# EAGLE schematic motor_controller (EAGLE 9.1.3)

## Sheet 1 of 2
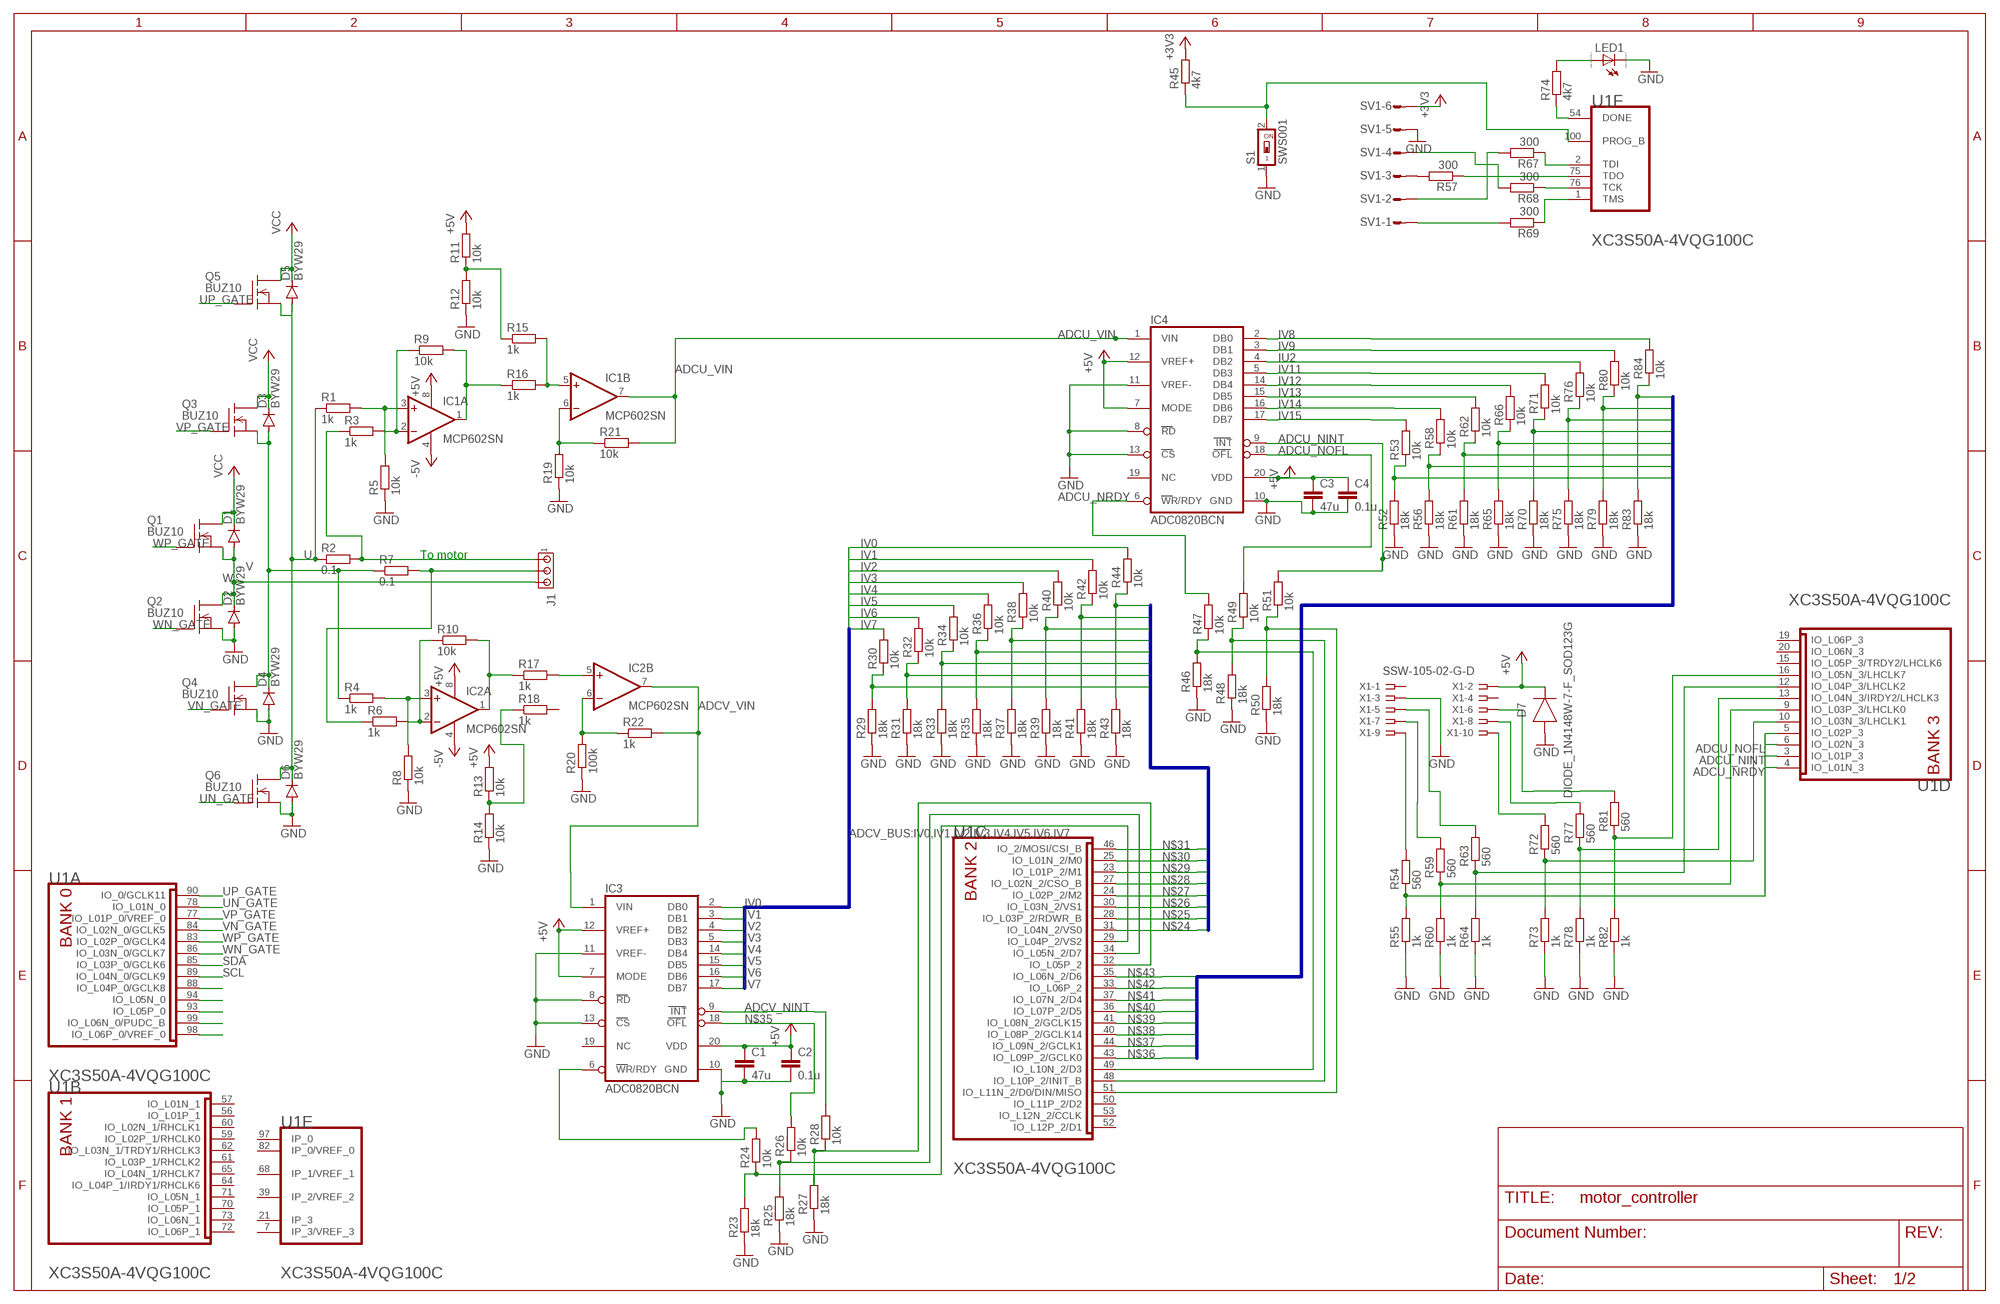
[diagram p0: schematic, sheet 1]

### Parts
C1  47u  C-EU025-040X050  [C025-040X050]
C2  0.1u  C-EUC1206  [C1206]
C3  47u  C-EU025-040X050  [C025-040X050]
C4  0.1u  C-EUC1206  [C1206]
D1  BYW29  [DO220S]
D2  BYW29  [DO220S]
D3  BYW29  [DO220S]
D4  BYW29  [DO220S]
D5  BYW29  [DO220S]
D6  BYW29  [DO220S]
D7  DIODE_1N4148W-7-F_SOD123G  [SOD3715X135]
IC1  MCP602SN  [SO08]
IC2  MCP602SN  [SO08]
IC3  ADC0820BCN  [DIL20]
IC4  ADC0820BCN  [DIL20]
J1  MTA03-156  [1X3MTA]
LED1  LED_E  [LED_1206]
Q1  BUZ10  [TO220]
Q2  BUZ10  [TO220]
Q3  BUZ10  [TO220]
Q4  BUZ10  [TO220]
Q5  BUZ10  [TO220]
Q6  BUZ10  [TO220]
R1  1k  R-EU_M1206  [M1206]
R2  0.1  R-EU_R2512  [R2512]
R3  1k  R-EU_M1206  [M1206]
R4  1k  R-EU_M1206  [M1206]
R5  10k  R-EU_M1206  [M1206]
R6  1k  R-EU_M1206  [M1206]
R7  0.1  R-EU_R2512  [R2512]
R8  10k  R-EU_M1206  [M1206]
R9  10k  R-EU_M1206  [M1206]
R10  10k  R-EU_M1206  [M1206]
R11  10k  R-EU_M1206  [M1206]
R12  10k  R-EU_M1206  [M1206]
R13  10k  R-EU_M1206  [M1206]
R14  10k  R-EU_M1206  [M1206]
R15  1k  R-EU_M1206  [M1206]
R16  1k  R-EU_M1206  [M1206]
R17  1k  R-EU_M1206  [M1206]
R18  1k  R-EU_M1206  [M1206]
R19  10k  R-EU_M1206  [M1206]
R20  100k  R-EU_M1206  [M1206]
R21  10k  R-EU_M1206  [M1206]
R22  1k  R-EU_M1206  [M1206]
R23  18k  R-EU_M1206  [M1206]
R24  10k  R-EU_M1206  [M1206]
R25  18k  R-EU_M1206  [M1206]
R26  10k  R-EU_M1206  [M1206]
R27  18k  R-EU_M1206  [M1206]
R28  10k  R-EU_M1206  [M1206]
R29  18k  R-EU_M1206  [M1206]
R30  10k  R-EU_M1206  [M1206]
R31  18k  R-EU_M1206  [M1206]
R32  10k  R-EU_M1206  [M1206]
R33  18k  R-EU_M1206  [M1206]
R34  10k  R-EU_M1206  [M1206]
R35  18k  R-EU_M1206  [M1206]
R36  10k  R-EU_M1206  [M1206]
R37  18k  R-EU_M1206  [M1206]
R38  10k  R-EU_M1206  [M1206]
R39  18k  R-EU_M1206  [M1206]
R40  10k  R-EU_M1206  [M1206]
R41  18k  R-EU_M1206  [M1206]
R42  10k  R-EU_M1206  [M1206]
R43  18k  R-EU_M1206  [M1206]
R44  10k  R-EU_M1206  [M1206]
R45  4k7  R-EU_M1206  [M1206]
R46  18k  R-EU_M1206  [M1206]
R47  10k  R-EU_M1206  [M1206]
R48  18k  R-EU_M1206  [M1206]
R49  10k  R-EU_M1206  [M1206]
R50  18k  R-EU_M1206  [M1206]
R51  10k  R-EU_M1206  [M1206]
R52  18k  R-EU_M1206  [M1206]
R53  10k  R-EU_M1206  [M1206]
R54  560  R-EU_M1206  [M1206]
R55  1k  R-EU_M1206  [M1206]
R56  18k  R-EU_M1206  [M1206]
R57  300  R-EU_M1206  [M1206]
R58  10k  R-EU_M1206  [M1206]
R59  560  R-EU_M1206  [M1206]
R60  1k  R-EU_M1206  [M1206]
R61  18k  R-EU_M1206  [M1206]
R62  10k  R-EU_M1206  [M1206]
R63  560  R-EU_M1206  [M1206]
R64  1k  R-EU_M1206  [M1206]
R65  18k  R-EU_M1206  [M1206]
R66  10k  R-EU_M1206  [M1206]
R67  300  R-EU_M1206  [M1206]
R68  300  R-EU_M1206  [M1206]
R69  300  R-EU_M1206  [M1206]
R70  18k  R-EU_M1206  [M1206]
R71  10k  R-EU_M1206  [M1206]
R72  560  R-EU_M1206  [M1206]
R73  1k  R-EU_M1206  [M1206]
R74  4k7  R-EU_M1206  [M1206]
R75  18k  R-EU_M1206  [M1206]
R76  10k  R-EU_M1206  [M1206]
R77  560  R-EU_M1206  [M1206]
R78  1k  R-EU_M1206  [M1206]
R79  18k  R-EU_M1206  [M1206]
R80  10k  R-EU_M1206  [M1206]
R81  560  R-EU_M1206  [M1206]
R82  1k  R-EU_M1206  [M1206]
R83  18k  R-EU_M1206  [M1206]
R84  10k  R-EU_M1206  [M1206]
S1  SWS001  [SMS-001]
SV1  MT6-6Y  [MT6-6Y]
U1  XILINX_XC3S50A-4VQG100CXILINX_XC3S50A-4VQG100C_0_0  [XILINX_XC3S50A-4VQG100C_0]
X1  SSW-105-02-G-D  [SSW-105-02-G-D]

### Nets
+3V3: R45.2 SV1.6 ; also sheet 2
+5V: C1.1 C2.1 C3.1 C4.1 D7.1(C) IC1.8(P:V+) IC2.8(P:V+) IC3.7(MODE) IC3.12(VREF+) IC3.20(VDD) IC4.7(MODE) IC4.12(VREF+) IC4.20(VDD) R11.2 R13.2 X1.2 ; also sheet 2
-5V: IC1.4(P:V-) IC2.4(P:V-) ; also sheet 2
ADCU_NINT: IC4.9(INT) R51.2 U1.3(D:IO_L01P_3)
ADCU_NOFL: IC4.18(OFL) R49.2 U1.6(D:IO_L02N_3)
ADCU_NRDY: IC4.6(WR/RDY) R47.2 U1.4(D:IO_L01N_3)
ADCU_VIN: IC1.7(B:OUT) IC4.1(VIN) R21.2
ADCV_NINT: IC3.9(INT) R28.2
ADCV_NRDY: IC3.6(WR/RDY) R24.2
ADCV_VIN: IC2.7(B:OUT) IC3.1(VIN) R22.2
GND: C1.2 C2.2 C3.2 C4.2 D2.A D4.A D6.A D7.2(A) IC3.8(RD) IC3.10(GND) IC3.11(VREF-) IC3.13(CS) IC4.8(RD) IC4.10(GND) IC4.11(VREF-) IC4.13(CS) LED1.C Q2.3(S) Q4.3(S) Q6.3(S) R5.1 R8.1 R12.1 R14.1 R19.1 R20.1 R23.1 R25.1 R27.1 R29.1 R31.1 R33.1 R35.1 R37.1 R39.1 R41.1 R43.1 R46.1 R48.1 R50.1 R52.1 R55.1 R56.1 R60.1 R61.1 R64.1 R65.1 R70.1 R73.1 R75.1 R78.1 R79.1 R82.1 R83.1 S1.1 SV1.5 X1.3 ; also sheet 2
IU2: IC4.4(DB2) R76.2
IV0: IC3.2(DB0) R44.2
IV1: IC3.3(DB1) R42.2
IV2: IC3.4(DB2) R40.2
IV3: IC3.5(DB3) R38.2
IV4: IC3.14(DB4) R36.2
IV5: IC3.15(DB5) R34.2
IV6: IC3.16(DB6) R32.2
IV7: IC3.17(DB7) R30.2
IV8: IC4.2(DB0) R84.2
IV9: IC4.3(DB1) R80.2
IV11: IC4.5(DB3) R71.2
IV12: IC4.14(DB4) R66.2
IV13: IC4.15(DB5) R62.2
IV14: IC4.16(DB6) R58.2
IV15: IC4.17(DB7) R53.2
N$1: J1.2 R6.1 R7.2
N$2: J1.1 R2.2 R3.1
N$3: IC2.5(B:+IN) R17.2
N$4: IC1.3(A:+IN) R1.2 R5.2
N$5: IC1.1(A:OUT) R9.2 R16.1
N$7: R67.1 U1.2(F:TDI)
N$8: R68.1 U1.76(F:TCK)
N$9: D5.A Q5.3(S)
N$10: U1.88(A:IO_L04P_0/GCLK8)
N$11: U1.94(A:IO_L05N_0)
N$12: U1.93(A:IO_L05P_0)
N$13: U1.99(A:IO_L06N_0/PUDC_B)
N$14: U1.98(A:IO_L06P_0/VREF_0)
N$15: IC2.1(A:OUT) R10.2 R17.1
N$16: IC2.2(A:-IN) R6.2 R10.1
N$20: IC1.2(A:-IN) R3.2 R9.1
N$21: IC1.6(B:-IN) R19.2 R21.1
N$22: IC2.3(A:+IN) R4.2 R8.2
N$23: IC2.6(B:-IN) R20.2 R22.1
N$24: R29.2 R30.1 U1.31(C:IO_L04N_2/VS0)
N$25: R31.2 R32.1 U1.28(C:IO_L03P_2/RDWR_B)
N$26: R33.2 R34.1 U1.30(C:IO_L03N_2/VS1)
N$27: R35.2 R36.1 U1.24(C:IO_L02P_2/M2)
N$28: R37.2 R38.1 U1.27(C:IO_L02N_2/CSO_B)
N$29: R39.2 R40.1 U1.23(C:IO_L01P_2/M1)
N$30: R41.2 R42.1 U1.25(C:IO_L01N_2/M0)
N$31: R43.2 R44.1 U1.46(C:IO_2/MOSI/CSI_B)
N$32: R23.2 R24.1 U1.29(C:IO_L04P_2/VS2)
N$33: R25.2 R26.1 U1.34(C:IO_L05N_2/D7)
N$34: R27.2 R28.1 U1.32(C:IO_L05P_2)
N$35: IC3.18(OFL) R26.2
N$36: R52.2 R53.1 U1.43(C:IO_L09P_2/GCLK0)
N$37: R56.2 R58.1 U1.44(C:IO_L09N_2/GCLK1)
N$38: R61.2 R62.1 U1.40(C:IO_L08P_2/GCLK14)
N$39: R65.2 R66.1 U1.41(C:IO_L08N_2/GCLK15)
N$40: R70.2 R71.1 U1.36(C:IO_L07P_2/D5)
N$41: R75.2 R76.1 U1.37(C:IO_L07N_2/D4)
N$42: R79.2 R80.1 U1.33(C:IO_L06P_2)
N$43: R83.2 R84.1 U1.35(C:IO_L06N_2/D6)
N$44: R50.2 R51.1 U1.51(C:IO_L11N_2/D0/DIN/MISO)
N$45: R48.2 R49.1 U1.48(C:IO_L10P_2/INIT_B)
N$46: R46.2 R47.1 U1.49(C:IO_L10N_2/D3)
N$47: R69.1 U1.1(F:TMS)
N$48: R69.2 SV1.1
N$49: R67.2 SV1.2
N$50: R68.2 SV1.4
N$51: R57.2 SV1.3
N$52: R57.1 U1.75(F:TDO)
N$53: LED1.A R74.2
N$54: R45.1 S1.2 U1.100(F:PROG_B)
N$55: R74.1 U1.54(F:DONE)
N$56: R63.2 X1.5
N$57: R59.2 X1.7
N$58: R54.2 X1.9
N$59: IC1.5(B:+IN) R15.2 R16.2
N$60: R77.2 X1.8
N$61: R72.2 X1.10
N$62: R54.1 R55.2 U1.5(D:IO_L02P_3)
N$63: R59.1 R60.2 U1.9(D:IO_L03P_3/LHCLK0)
N$64: R63.1 R64.2 U1.12(D:IO_L04P_3/LHCLK2)
N$65: R81.2 X1.6
N$66: R13.1 R14.2 R18.1
N$67: R11.1 R12.2 R15.1
N$68: R72.1 R73.2 U1.10(D:IO_L03N_3/LHCLK1)
N$69: R77.1 R78.2 U1.13(D:IO_L04N_3/IRDY2/LHCLK3)
N$70: R81.1 R82.2 U1.16(D:IO_L05N_3/LHCLK7)
SCL: U1.89(A:IO_L04N_0/GCLK9) ; also sheet 2
SDA: U1.85(A:IO_L03P_0/GCLK6) ; also sheet 2
U: D6.C Q6.2(D) R1.1 R2.1
UN_GATE: Q6.1(G) U1.78(A:IO_L01N_0)
UP_GATE: Q5.1(G) U1.90(A:IO_0/GCLK11)
V: D3.A D4.C Q3.3(S) Q4.2(D) R4.1 R7.1
VCC: D1.C D3.C D5.C Q1.2(D) Q3.2(D) Q5.2(D)
VN_GATE: Q4.1(G) U1.84(A:IO_L02N_0/GCLK5)
VP_GATE: Q3.1(G) U1.77(A:IO_L01P_0/VREF_0)
W: D1.A D2.C J1.3 Q1.3(S) Q2.2(D)
WN_GATE: Q2.1(G) U1.86(A:IO_L03N_0/GCLK7)
WP_GATE: Q1.1(G) U1.83(A:IO_L02P_0/GCLK4)
Unconnected: IC3.19(NC) IC4.19(NC) R18.2 U1.7(E:IP_3/VREF_3) U1.15(D:IO_L05P_3/TRDY2/LHCLK6) U1.19(D:IO_L06P_3) U1.20(D:IO_L06N_3) U1.21(E:IP_3) U1.39(E:IP_2/VREF_2) U1.50(C:IO_L11P_2/D2) U1.52(C:IO_L12P_2/D1) U1.53(C:IO_L12N_2/CCLK) U1.56(B:IO_L01P_1) U1.57(B:IO_L01N_1) U1.59(B:IO_L02P_1/RHCLK0) U1.60(B:IO_L02N_1/RHCLK1) U1.61(B:IO_L03P_1/RHCLK2) U1.62(B:IO_L03N_1/TRDY1/RHCLK3) U1.64(B:IO_L04P_1/IRDY1/RHCLK6) U1.65(B:IO_L04N_1/RHCLK7) U1.68(E:IP_1/VREF_1) U1.70(B:IO_L05P_1) U1.71(B:IO_L05N_1) U1.72(B:IO_L06P_1) U1.73(B:IO_L06N_1) U1.82(E:IP_0/VREF_0) U1.97(E:IP_0) X1.1 X1.4

### Buses
ADCV_BUS:IV0,IV1,IV2,IV3,IV4,IV5,IV6,IV7
N$24,N$25,N$26,N$27,N$28,N$29,N$30,N$31
N$36,N$37,N$38,N$39,N$40,N$41,N$42,N$43

### Notes on the sheet
- To motor

## Sheet 2 of 2
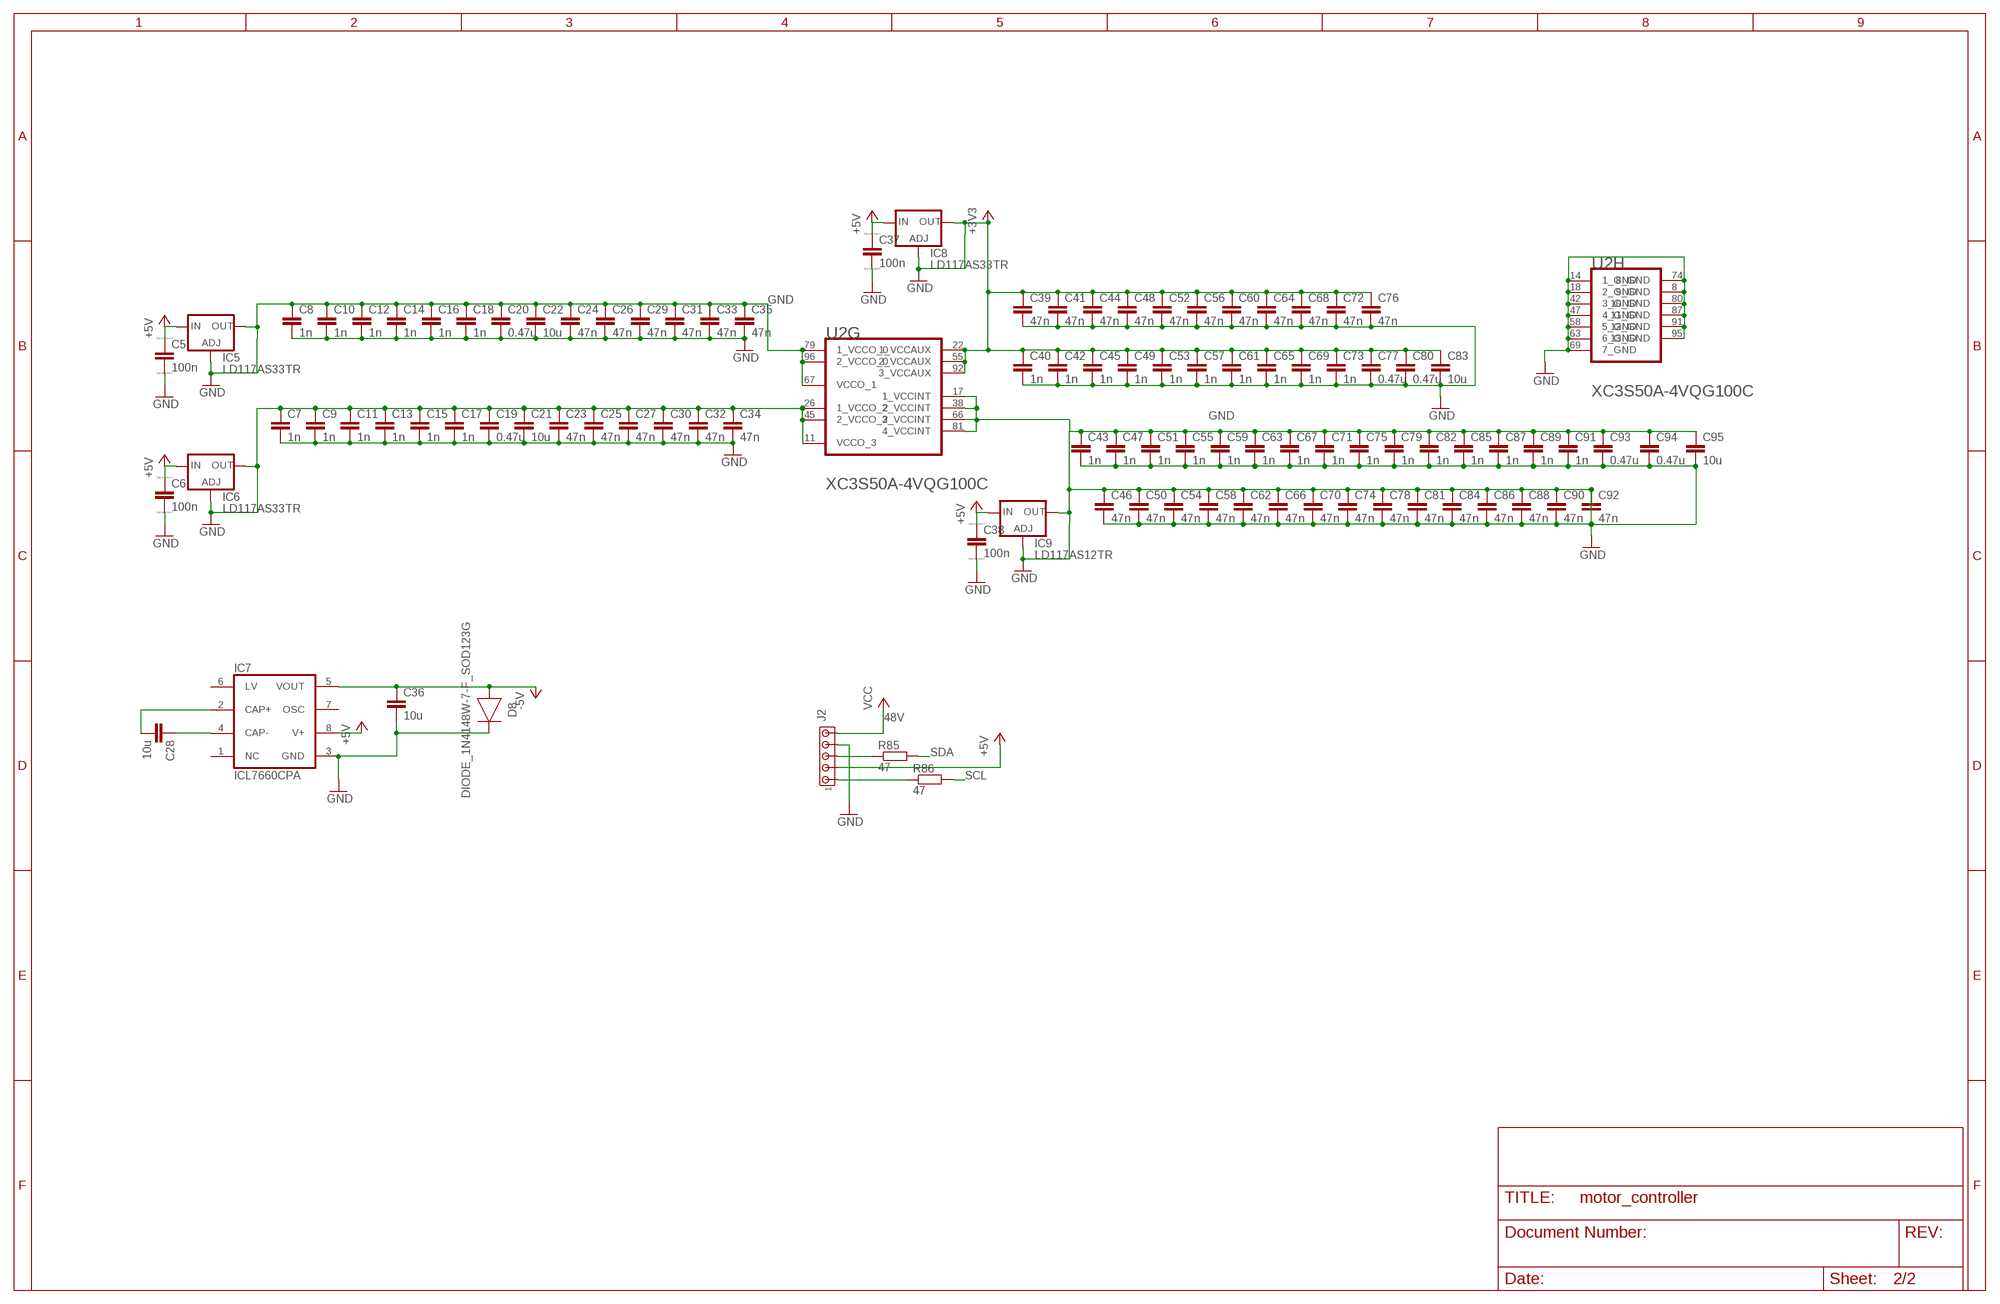
[diagram p1: schematic, sheet 2]

### Parts
C5  100n  CC1206  [C1206]
C6  100n  CC1206  [C1206]
C7  1n  C-EUC1206  [C1206]
C8  1n  C-EUC1206  [C1206]
C9  1n  C-EUC1206  [C1206]
C10  1n  C-EUC1206  [C1206]
C11  1n  C-EUC1206  [C1206]
C12  1n  C-EUC1206  [C1206]
C13  1n  C-EUC1206  [C1206]
C14  1n  C-EUC1206  [C1206]
C15  1n  C-EUC1206  [C1206]
C16  1n  C-EUC1206  [C1206]
C17  1n  C-EUC1206  [C1206]
C18  1n  C-EUC1206  [C1206]
C19  0.47u  C-EUC1206  [C1206]
C20  0.47u  C-EUC1206  [C1206]
C21  10u  C-EUC1206  [C1206]
C22  10u  C-EUC1206  [C1206]
C23  47n  C-EUC1206  [C1206]
C24  47n  C-EUC1206  [C1206]
C25  47n  C-EUC1206  [C1206]
C26  47n  C-EUC1206  [C1206]
C27  47n  C-EUC1206  [C1206]
C28  10u  C-EUC1206  [C1206]
C29  47n  C-EUC1206  [C1206]
C30  47n  C-EUC1206  [C1206]
C31  47n  C-EUC1206  [C1206]
C32  47n  C-EUC1206  [C1206]
C33  47n  C-EUC1206  [C1206]
C34  47n  C-EUC1206  [C1206]
C35  47n  C-EUC1206  [C1206]
C36  10u  C-EUC1206  [C1206]
C37  100n  CC1206  [C1206]
C38  100n  CC1206  [C1206]
C39  47n  C-EUC1206  [C1206]
C40  1n  C-EUC1206  [C1206]
C41  47n  C-EUC1206  [C1206]
C42  1n  C-EUC1206  [C1206]
C43  1n  C-EUC1206  [C1206]
C44  47n  C-EUC1206  [C1206]
C45  1n  C-EUC1206  [C1206]
C46  47n  C-EUC1206  [C1206]
C47  1n  C-EUC1206  [C1206]
C48  47n  C-EUC1206  [C1206]
C49  1n  C-EUC1206  [C1206]
C50  47n  C-EUC1206  [C1206]
C51  1n  C-EUC1206  [C1206]
C52  47n  C-EUC1206  [C1206]
C53  1n  C-EUC1206  [C1206]
C54  47n  C-EUC1206  [C1206]
C55  1n  C-EUC1206  [C1206]
C56  47n  C-EUC1206  [C1206]
C57  1n  C-EUC1206  [C1206]
C58  47n  C-EUC1206  [C1206]
C59  1n  C-EUC1206  [C1206]
C60  47n  C-EUC1206  [C1206]
C61  1n  C-EUC1206  [C1206]
C62  47n  C-EUC1206  [C1206]
C63  1n  C-EUC1206  [C1206]
C64  47n  C-EUC1206  [C1206]
C65  1n  C-EUC1206  [C1206]
C66  47n  C-EUC1206  [C1206]
C67  1n  C-EUC1206  [C1206]
C68  47n  C-EUC1206  [C1206]
C69  1n  C-EUC1206  [C1206]
C70  47n  C-EUC1206  [C1206]
C71  1n  C-EUC1206  [C1206]
C72  47n  C-EUC1206  [C1206]
C73  1n  C-EUC1206  [C1206]
C74  47n  C-EUC1206  [C1206]
C75  1n  C-EUC1206  [C1206]
C76  47n  C-EUC1206  [C1206]
C77  0.47u  C-EUC1206  [C1206]
C78  47n  C-EUC1206  [C1206]
C79  1n  C-EUC1206  [C1206]
C80  0.47u  C-EUC1206  [C1206]
C81  47n  C-EUC1206  [C1206]
C82  1n  C-EUC1206  [C1206]
C83  10u  C-EUC1206  [C1206]
C84  47n  C-EUC1206  [C1206]
C85  1n  C-EUC1206  [C1206]
C86  47n  C-EUC1206  [C1206]
C87  1n  C-EUC1206  [C1206]
C88  47n  C-EUC1206  [C1206]
C89  1n  C-EUC1206  [C1206]
C90  47n  C-EUC1206  [C1206]
C91  1n  C-EUC1206  [C1206]
C92  47n  C-EUC1206  [C1206]
C93  0.47u  C-EUC1206  [C1206]
C94  0.47u  C-EUC1206  [C1206]
C95  10u  C-EUC1206  [C1206]
D8  DIODE_1N4148W-7-F_SOD123G  [SOD3715X135]
IC5  LD117AS33TR  [SOT223]
IC6  LD117AS33TR  [SOT223]
IC7  ICL7660CPA  [DIL08]
IC8  LD117AS33TR  [SOT223]
IC9  LD117AS12TR  [SOT223]
J2  MTA05-156  [1X5MTA]
R85  47  R-EU_M1206  [M1206]
R86  47  R-EU_M1206  [M1206]
U2  XILINX_XC3S50A-4VQG100CXILINX_XC3S50A-4VQG100C_0_0  [XILINX_XC3S50A-4VQG100C_0]

### Nets
48V: J2.5 ; supply symbol labelled VCC
+3V3: C39.1 C40.1 C41.1 C42.1 C44.1 C45.1 C48.1 C49.1 C52.1 C53.1 C56.1 C57.1 C60.1 C61.1 C64.1 C65.1 C68.1 C69.1 C72.1 C73.1 C76.1 C77.1 C80.1 C83.1 IC8.1(ADJ) IC8.4(OUT) U2.22(G:1_VCCAUX) U2.55(G:2_VCCAUX) U2.92(G:3_VCCAUX) ; supply symbol labelled GND ; also sheet 1
+5V: C5.1 C6.1 C37.1 C38.1 IC5.3(IN) IC6.3(IN) IC7.8(V+) IC8.3(IN) IC9.3(IN) J2.2 ; also sheet 1
-5V: C36.1 D8.2(A) IC7.5(VOUT) ; also sheet 1
GND: C5.2 C6.2 C7.1 C7.2 C8.1 C8.2 C9.1 C9.2 C10.1 C10.2 C11.1 C11.2 C12.1 C12.2 C13.1 C13.2 C14.1 C14.2 C15.1 C15.2 C16.1 C16.2 C17.1 C17.2 C18.1 C18.2 C19.1 C19.2 C20.1 C20.2 C21.1 C21.2 C22.1 C22.2 C23.1 C23.2 C24.1 C24.2 C25.1 C25.2 C26.1 C26.2 C27.1 C27.2 C29.1 C29.2 C30.1 C30.2 C31.1 C31.2 C32.1 C32.2 C33.1 C33.2 C34.1 C34.2 C35.1 C35.2 C36.2 C37.2 C38.2 C39.2 C40.2 C41.2 C42.2 C43.1 C43.2 C44.2 C45.2 C46.1 C46.2 C47.1 C47.2 C48.2 C49.2 C50.1 C50.2 C51.1 C51.2 C52.2 C53.2 C54.1 C54.2 C55.1 C55.2 C56.2 C57.2 C58.1 C58.2 C59.1 C59.2 C60.2 C61.2 C62.1 C62.2 C63.1 C63.2 C64.2 C65.2 C66.1 C66.2 C67.1 C67.2 C68.2 C69.2 C70.1 C70.2 C71.1 C71.2 C72.2 C73.2 C74.1 C74.2 C75.1 C75.2 C76.2 C77.2 C78.1 C78.2 C79.1 C79.2 C80.2 C81.1 C81.2 C82.1 C82.2 C83.2 C84.1 C84.2 C85.1 C85.2 C86.1 C86.2 C87.1 C87.2 C88.1 C88.2 C89.1 C89.2 C90.1 C90.2 C91.1 C91.2 C92.1 C92.2 C93.1 C93.2 C94.1 C94.2 C95.1 C95.2 D8.1(C) IC5.1(ADJ) IC5.4(OUT) IC6.1(ADJ) IC6.4(OUT) IC7.3(GND) IC9.1(ADJ) IC9.4(OUT) J2.4 U2.8(H:9_GND) U2.11(G:VCCO_3) U2.14(H:1_GND) U2.17(G:1_VCCINT) U2.18(H:2_GND) U2.26(G:1_VCCO_2) U2.38(G:2_VCCINT) U2.42(H:3_GND) U2.45(G:2_VCCO_2) U2.47(H:4_GND) U2.58(H:5_GND) U2.63(H:6_GND) U2.66(G:3_VCCINT) U2.67(G:VCCO_1) U2.69(H:7_GND) U2.74(H:8_GND) U2.79(G:1_VCCO_0) U2.80(H:10_GND) U2.81(G:4_VCCINT) U2.87(H:11_GND) U2.91(H:12_GND) U2.95(H:13_GND) U2.96(G:2_VCCO_0) ; also sheet 1
N$6: C28.1 IC7.4(CAP-)
N$17: J2.3 R85.1
N$18: J2.1 R86.1
N$19: C28.2 IC7.2(CAP+)
SCL: R86.2 ; also sheet 1
SDA: R85.2 ; also sheet 1
Unconnected: IC7.1(NC) IC7.6(LV) IC7.7(OSC) U2.1(F:TMS) U2.2(F:TDI) U2.3(D:IO_L01P_3) U2.4(D:IO_L01N_3) U2.5(D:IO_L02P_3) U2.6(D:IO_L02N_3) U2.7(E:IP_3/VREF_3) U2.9(D:IO_L03P_3/LHCLK0) U2.10(D:IO_L03N_3/LHCLK1) U2.12(D:IO_L04P_3/LHCLK2) U2.13(D:IO_L04N_3/IRDY2/LHCLK3) U2.15(D:IO_L05P_3/TRDY2/LHCLK6) U2.16(D:IO_L05N_3/LHCLK7) U2.19(D:IO_L06P_3) U2.20(D:IO_L06N_3) U2.21(E:IP_3) U2.23(C:IO_L01P_2/M1) U2.24(C:IO_L02P_2/M2) U2.25(C:IO_L01N_2/M0) U2.27(C:IO_L02N_2/CSO_B) U2.28(C:IO_L03P_2/RDWR_B) U2.29(C:IO_L04P_2/VS2) U2.30(C:IO_L03N_2/VS1) U2.31(C:IO_L04N_2/VS0) U2.32(C:IO_L05P_2) U2.33(C:IO_L06P_2) U2.34(C:IO_L05N_2/D7) U2.35(C:IO_L06N_2/D6) U2.36(C:IO_L07P_2/D5) U2.37(C:IO_L07N_2/D4) U2.39(E:IP_2/VREF_2) U2.40(C:IO_L08P_2/GCLK14) U2.41(C:IO_L08N_2/GCLK15) U2.43(C:IO_L09P_2/GCLK0) U2.44(C:IO_L09N_2/GCLK1) U2.46(C:IO_2/MOSI/CSI_B) U2.48(C:IO_L10P_2/INIT_B) U2.49(C:IO_L10N_2/D3) U2.50(C:IO_L11P_2/D2) U2.51(C:IO_L11N_2/D0/DIN/MISO) U2.52(C:IO_L12P_2/D1) U2.53(C:IO_L12N_2/CCLK) U2.54(F:DONE) U2.56(B:IO_L01P_1) U2.57(B:IO_L01N_1) U2.59(B:IO_L02P_1/RHCLK0) U2.60(B:IO_L02N_1/RHCLK1) U2.61(B:IO_L03P_1/RHCLK2) U2.62(B:IO_L03N_1/TRDY1/RHCLK3) U2.64(B:IO_L04P_1/IRDY1/RHCLK6) U2.65(B:IO_L04N_1/RHCLK7) U2.68(E:IP_1/VREF_1) U2.70(B:IO_L05P_1) U2.71(B:IO_L05N_1) U2.72(B:IO_L06P_1) U2.73(B:IO_L06N_1) U2.75(F:TDO) U2.76(F:TCK) U2.77(A:IO_L01P_0/VREF_0) U2.78(A:IO_L01N_0) U2.82(E:IP_0/VREF_0) U2.83(A:IO_L02P_0/GCLK4) U2.84(A:IO_L02N_0/GCLK5) U2.85(A:IO_L03P_0/GCLK6) U2.86(A:IO_L03N_0/GCLK7) U2.88(A:IO_L04P_0/GCLK8) U2.89(A:IO_L04N_0/GCLK9) U2.90(A:IO_0/GCLK11) U2.93(A:IO_L05P_0) U2.94(A:IO_L05N_0) U2.97(E:IP_0) U2.98(A:IO_L06P_0/VREF_0) U2.99(A:IO_L06N_0/PUDC_B) U2.100(F:PROG_B)

## Power pins joined to a net without a drawn wire
1_GND: U1.14(H:1_GND)
1_VCCAUX: U1.22(G:1_VCCAUX)
1_VCCINT: U1.17(G:1_VCCINT)
1_VCCO_0: U1.79(G:1_VCCO_0)
1_VCCO_2: U1.26(G:1_VCCO_2)
2_GND: U1.18(H:2_GND)
2_VCCAUX: U1.55(G:2_VCCAUX)
2_VCCINT: U1.38(G:2_VCCINT)
2_VCCO_0: U1.96(G:2_VCCO_0)
2_VCCO_2: U1.45(G:2_VCCO_2)
3_GND: U1.42(H:3_GND)
3_VCCAUX: U1.92(G:3_VCCAUX)
3_VCCINT: U1.66(G:3_VCCINT)
4_GND: U1.47(H:4_GND)
4_VCCINT: U1.81(G:4_VCCINT)
5_GND: U1.58(H:5_GND)
6_GND: U1.63(H:6_GND)
7_GND: U1.69(H:7_GND)
8_GND: U1.74(H:8_GND)
9_GND: U1.8(H:9_GND)
10_GND: U1.80(H:10_GND)
11_GND: U1.87(H:11_GND)
12_GND: U1.91(H:12_GND)
13_GND: U1.95(H:13_GND)
VCCO_1: U1.67(G:VCCO_1)
VCCO_3: U1.11(G:VCCO_3)

## Library data of the parts
C1-C4 C7-C36 C39-C95 = rcl:C-EU: CAPACITOR, European symbol; SPICEPREFIX: C
C5 C6 C37 C38 = eagle-ltspice:C: CAPACITOR, European symbol; SPICEMODEL: NONE; SPICEPREFIX: C
D1-D6 = diode:BYW29: DIODE ultra fast rectifier, 200 V, 8 A
D7 D8 = Diode:DIODE_: Diode Rectifier - Popular parts; CATEGORY: Diode; DESCRIPTION: DIODE GEN PURP 100V 300MA SOD123; MANUFACTURER: Diodes Incorporated; SUB-CATEGORY: Rectifier
IC1 IC2 = linear:MCP602: Single Op Amp 2.7V to 6.0V Single Supply CMOS Source: http://ww1.microchip.com/downloads/en/DeviceDoc/21314g.pdf
IC3 IC4 = maxim:ADC0820BCN: ANALOG/DIGITAL CONVERTER; MF: NATIONAL SEMICONDUCTOR; MPN: ADC0820CCN/NOPB.; OC_FARNELL: 1189415; OC_NEWARK: unknown
IC5 IC6 IC8 IC9 = v-reg:LD117A?*: Low drop fixed and adjustable positive voltage regulators 1 A Source: http://www.st.com/stonline/products/literature/ds/7194/ld1117axx.pdf
IC7 = maxim:ICL7660CPA: VOLTAGE CONVERTER; MF: INTERSIL; MPN: ICL7660CPA; OC_FARNELL: 1018170; OC_NEWARK: 06F7441
J1 = con-amp:MTA03-156: AMP connector
J2 = con-amp:MTA05-156: AMP connector
LED1 = eagle-ltspice:LED_E: LED Source: http://www.osram.convergy.de Source: www.luxeon.com Source: www.kingbright.com; SPICEMODEL: NONE; SPICEPREFIX: D; SPICETYPE: diode
Q1-Q6 = transistor-fet:BUZ10: N-Channel Enhancement MOSFET 50V; 20A; 0,080Ohm
R1-R84 = resistor:R-EU_: RESISTOR, European symbol
R85 R86 = rcl:R-EU_: RESISTOR, European symbol; SPICEPREFIX: R
S1 = smd-special:SWS001: SMD Dip Switch 1 pol.
SV1 = con-amp-mt6:MT6-6Y: AMP MT6 CONNECTOR; OC_FARNELL: unknown; OC_NEWARK: unknown
U1 U2 = Xilinx - XC3S50A-4VQG100C:XILINX_XC3S50A-4VQG100C: FPGA-XSP-XC3S50A-VQ100; CIIVA_IDS: 969722; CODE__JEDEC: MS-026-AED; DATASHEET_VERSION: ver1.8, Mar-2009; FOOTPRINT_VARIANT_NAME_0: Level C; FOOTPRINT_VARIANT_NAME_1: Level B; FOOTPRINT_VARIANT_NAME_2: Level A; IMPORTED: yes; IMPORTED_FROM: vault; IMPORT_TS: 1521866917; MF: Xilinx; MPN: XC3S50A-4VQG100C; PACKAGE: VQG100; PACKAGE_DESCRIPTION: 100-Pin Very Thin Quad Flat Pack (VQG100) - Pb-Free; PACKAGE_VERSION: ver1.2.1, Feb-2007; PIN_0_5_2_INSIDE_EDGE: clock; PREFIX: U; RELEASE_DATE: 1298004393; VAULT_GUID: A8426ADA-BBEF-4931-BDCF-1792DE133352; VAULT_REVISION: FF63C8BF-BEC3-4327-8A72-16ACE5AF5753
X1 = con-samtec:SSW-105-02-G: THROUGH-HOLE .025" SQ POST SOCKET Source: Samtec SSW.pdf; MF: Samtec Inc.; MPN: SSW-105-02-G-D; OC_FARNELL: unknown; OC_NEWARK: 11P9398